# EAGLE design GPduino-R (EAGLE 6.5.0)
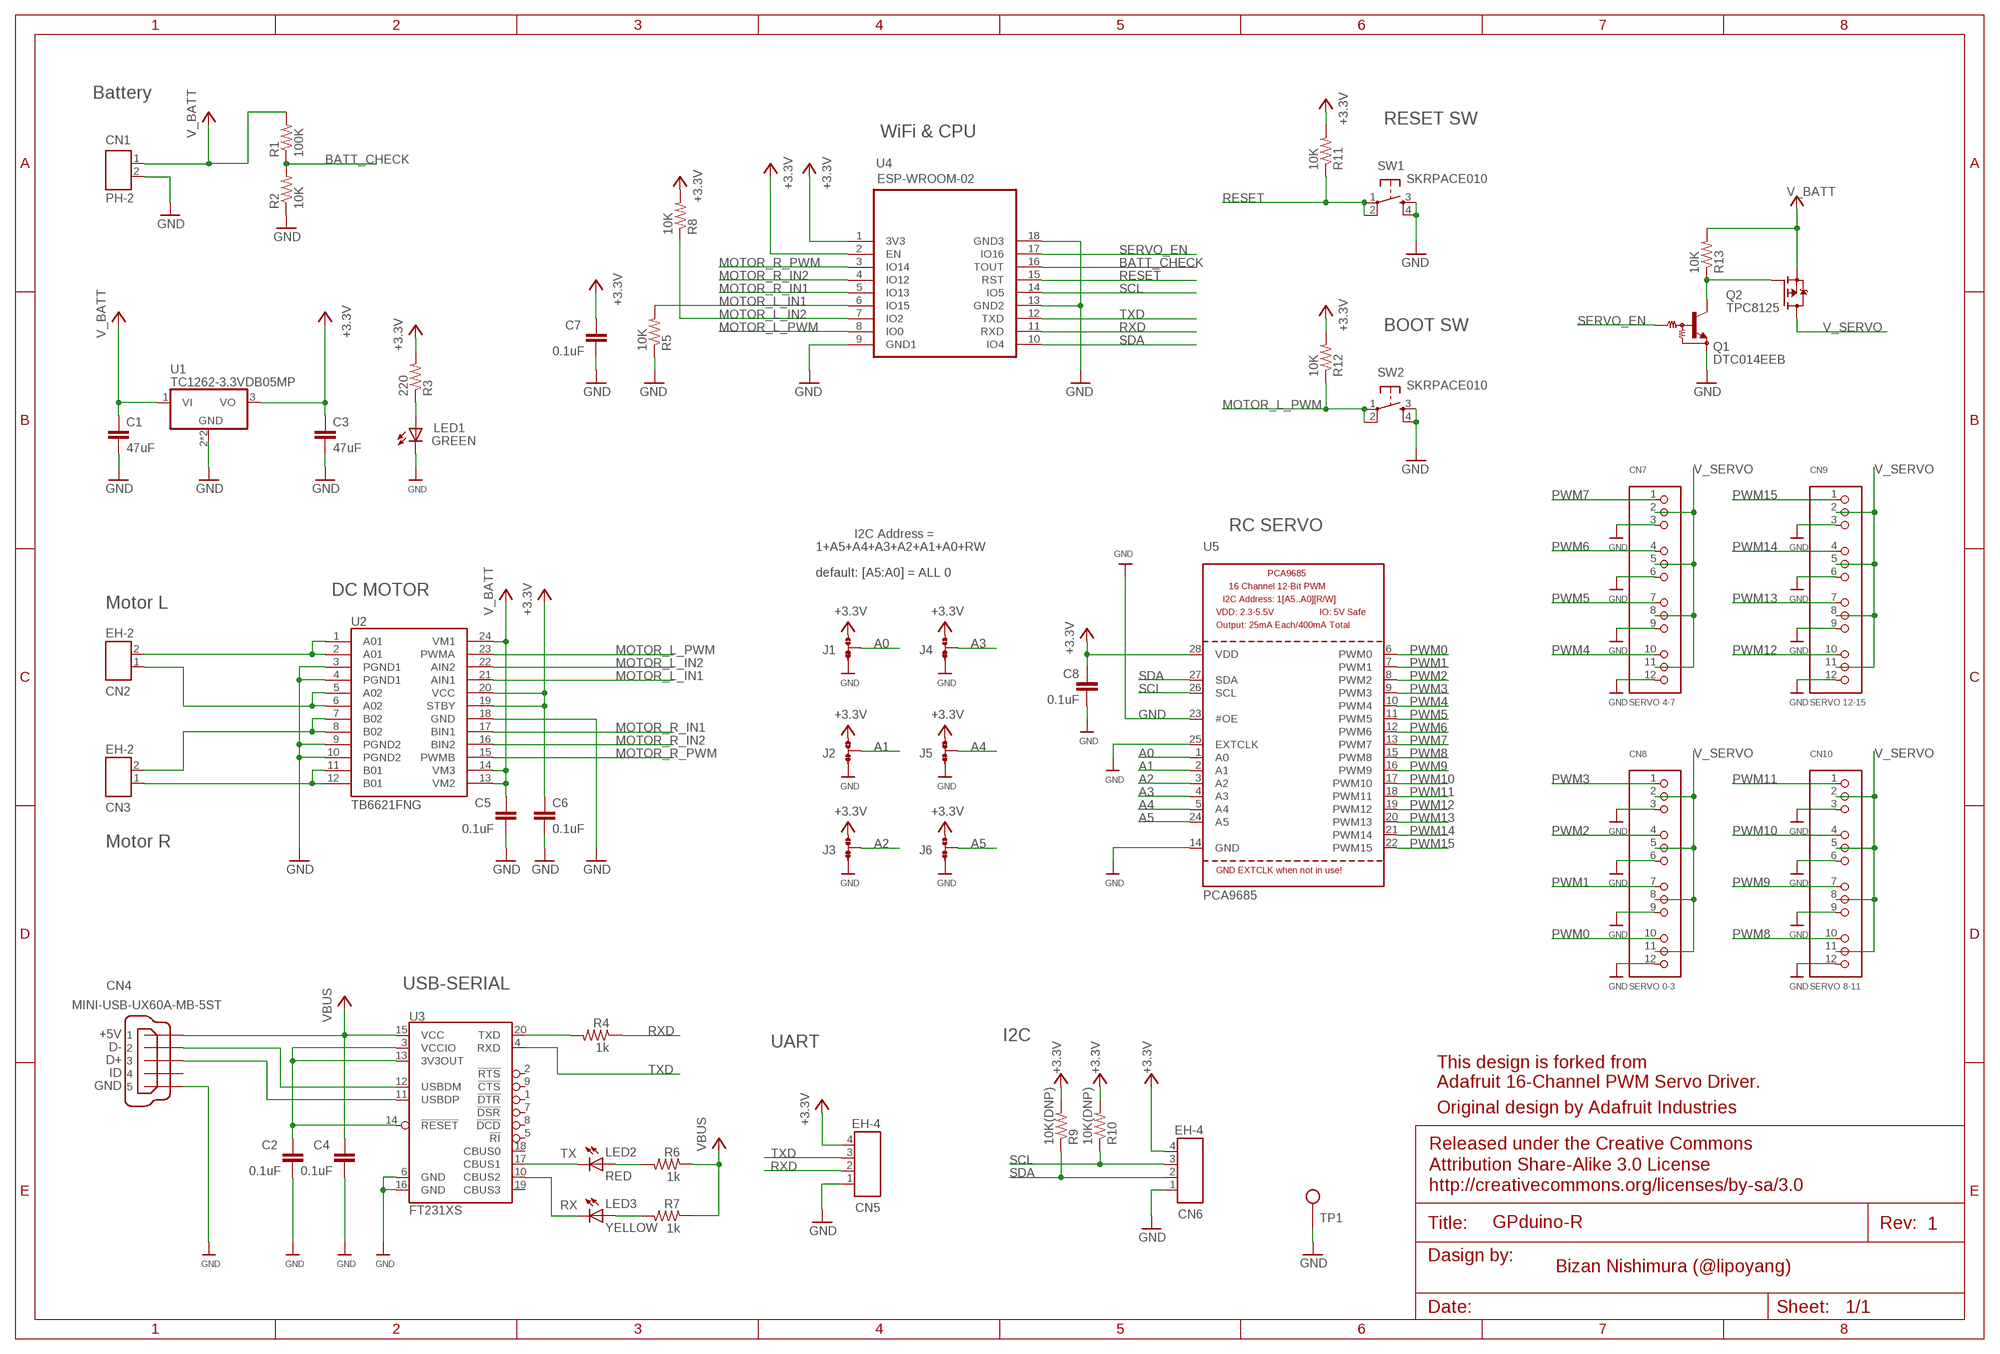
[diagram p0: schematic, sheet 1]

## Parts
C1  47uF  C-EUC3216  [C3216]
C2  0.1uF  C-EUC1608  [C1608]
C3  47uF  C-EUC3216  [C3216]
C4  0.1uF  C-EUC1608  [C1608]
C5  0.1uF  C-EUC1608  [C1608]
C6  0.1uF  C-EUC1608  [C1608]
C7  0.1uF  C-EUC1608  [C1608]
C8  0.1uF  C-EUC1608  [C1608]
CN1  PH-2  [PH-2]
CN2  EH-2  [EH-2]
CN3  EH-2  [EH-2]
CN4  MINI-USB-UX60A-MB-5ST  [UX60A-MB-5ST]
CN5  EH-4  [EH-4]
CN6  EH-4  [EH-4]
CN7  SERVO 4-7  HEADER-3X04  [3X04]
CN8  SERVO 0-3  HEADER-3X04  [3X04]
CN9  SERVO 12-15  HEADER-3X04  [3X04]
CN10  SERVO 8-11  HEADER-3X04  [3X04]
J1  JUMP-SHORTB  [JUMP-SHORT]
J2  JUMP-SHORTB  [JUMP-SHORT]
J3  JUMP-SHORTB  [JUMP-SHORT]
J4  JUMP-SHORTB  [JUMP-SHORT]
J5  JUMP-SHORTB  [JUMP-SHORT]
J6  JUMP-SHORTB  [JUMP-SHORT]
LED1  GREEN  LEDCHIPLED_0603  [CHIPLED_0603]
LED2  RED  LEDCHIPLED_0603  [CHIPLED_0603]
LED3  YELLOW  LEDCHIPLED_0603  [CHIPLED_0603]
Q1  DTC014EEB  DIGITORASC89  [SOT490]
Q2  TPC8125  [SO-8]
R1  100K  RESISTOR0603-RES  [0603-RES]
R2  10K  RESISTOR0603-RES  [0603-RES]
R3  220  RESISTOR0603-RES  [0603-RES]
R4  1k  RESISTOR0603-RES  [0603-RES]
R5  10K  RESISTOR0603-RES  [0603-RES]
R6  1k  RESISTOR0603-RES  [0603-RES]
R7  1k  RESISTOR0603-RES  [0603-RES]
R8  10K  RESISTOR0603-RES  [0603-RES]
R9  10K(DNP)  RESISTOR0603-RES  [0603-RES]
R10  10K(DNP)  RESISTOR0603-RES  [0603-RES]
R11  10K  RESISTOR0603-RES  [0603-RES]
R12  10K  RESISTOR0603-RES  [0603-RES]
R13  10K  RESISTOR0603-RES  [0603-RES]
SW1  SKRPACE010  [SKRPACE010]
SW2  SKRPACE010  [SKRPACE010]
TP1  TEST_PIN  [TEST_PIN]
U1  TC1262-3.3VDB05MP  [SOT223]
U2  TB6621FNG  [SSOP24]
U3  FT231XS  [SSOP20]
U4  ESP-WROOM-02  ESP-WROOM-02FRONT-FACE  [FRONT-FACE]
U5  PCA9685  [TSSOP28]

## Nets
+3V3: C3.1 C6.1 C7.1 C8.1 CN5.4 CN6.4 J1.1 J2.1 J3.1 J4.1 J5.1 J6.1 R3.2 R8.2 R9.2 R10.2 R11.2 R12.2 U1.3(VO) U2.19(STBY) U2.20(VCC) U4.1(3V3) U4.2(EN) U5.28(VDD) ; supply symbol labelled +3.3V
A0: J1.2 U5.1(A0)
A01: CN2.2 U2.1(A01) U2.2(A01)
A1: J2.2 U5.2(A1)
A02: CN2.1 U2.5(A02) U2.6(A02)
A2: J3.2 U5.3(A2)
A3: J4.2 U5.4(A3)
A4: J5.2 U5.5(A4)
A5: J6.2 U5.24(A5)
BATT_CHECK: R1.1 R2.2 U4.16(TOUT)
GND: C1.2 C2.2 C3.2 C4.2 C5.2 C6.2 C7.2 C8.2 CN1.2 CN4.5 CN5.1 CN6.1 CN7.3 CN7.6 CN7.9 CN7.12 CN8.3 CN8.6 CN8.9 CN8.12 CN9.3 CN9.6 CN9.9 CN9.12 CN10.3 CN10.6 CN10.9 CN10.12 J1.3 J2.3 J3.3 J4.3 J5.3 J6.3 LED1.C Q1.2(E) R2.1 R5.1 SW1.3 SW1.4 SW2.3 SW2.4 TP1.1 U1.2(GND) U1.4(GND) U2.3(PGND1) U2.4(PGND1) U2.9(PGND2) U2.10(PGND2) U2.18(GND) U3.6(GND) U3.16(GND) U4.9(GND1) U4.13(GND2) U4.18(GND3) U5.14(GND) U5.23(#OE) U5.25(EXTCLK)
MOTOR_L_IN1: R5.2 U2.21(AIN1) U4.6(IO15)
MOTOR_L_IN2: R8.1 U2.22(AIN2) U4.7(IO2)
MOTOR_L_PWM: R12.1 SW2.1 SW2.2 U2.23(PWMA) U4.8(IO0)
MOTOR_R_IN1: U2.17(BIN1) U4.5(IO13)
MOTOR_R_IN2: U2.16(BIN2) U4.4(IO12)
MOTOR_R_PWM: U2.15(PWMB) U4.3(IO14)
N$1: LED1.A R3.1
N$3: R4.2 U3.20(TXD)
N$5: CN3.1 U2.11(B01) U2.12(B01)
N$6: CN3.2 U2.7(B02) U2.8(B02)
N$8: LED2.C U3.17(CBUS1)
N$9: LED3.C U3.10(CBUS2)
N$10: LED2.A R6.2
N$11: LED3.A R7.2
N$13: CN4.2 U3.12(USBDM)
N$14: CN4.3 U3.11(USBDP)
N$15: C2.1 U3.3(VCCIO) U3.13(3V3OUT) U3.14(!RESET)
N$16: Q1.3(C) Q2.4(G) R13.1
PWM0: CN8.10 U5.6(PWM0)
PWM1: CN8.7 U5.7(PWM1)
PWM2: CN8.4 U5.8(PWM2)
PWM3: CN8.1 U5.9(PWM3)
PWM4: CN7.10 U5.10(PWM4)
PWM5: CN7.7 U5.11(PWM5)
PWM6: CN7.4 U5.12(PWM6)
PWM7: CN7.1 U5.13(PWM7)
PWM8: CN10.10 U5.15(PWM8)
PWM9: CN10.7 U5.16(PWM9)
PWM10: CN10.4 U5.17(PWM10)
PWM11: CN10.1 U5.18(PWM11)
PWM12: CN9.10 U5.19(PWM12)
PWM13: CN9.7 U5.20(PWM13)
PWM14: CN9.4 U5.21(PWM14)
PWM15: CN9.1 U5.22(PWM15)
RESET: R11.1 SW1.1 SW1.2 U4.15(RST)
RXD: CN5.2 R4.1 U4.11(RXD)
SCL: CN6.3 R10.1 U4.14(IO5) U5.26(SCL)
SDA: CN6.2 R9.1 U4.10(IO4) U5.27(SDA)
SERVO_EN: Q1.1(B) U4.17(IO16)
TXD: CN5.3 U3.4(RXD) U4.12(TXD)
V_BATT: C1.1 C5.1 CN1.1 Q2.1(S) Q2.2(S) Q2.3(S) R1.2 R13.2 U1.1(VI) U2.13(VM2) U2.14(VM3) U2.24(VM1)
V_SERVO: CN7.2 CN7.5 CN7.8 CN7.11 CN8.2 CN8.5 CN8.8 CN8.11 CN9.2 CN9.5 CN9.8 CN9.11 CN10.2 CN10.5 CN10.8 CN10.11 Q2.5(D) Q2.6(D) Q2.7(D) Q2.8(D)
VBUS: C4.1 CN4.1 R6.1 R7.1 U3.15(VCC)
Unconnected: CN4.4 U3.1(!DTR) U3.2(!RTS) U3.5(!RI) U3.7(!DSR) U3.8(!DCD) U3.9(!CTS) U3.18(CBUS0) U3.19(CBUS3)

## Notes on the sheet
- Battery
- RESET SW
- WiFi & CPU
- BOOT SW
- RC SERVO
- I2C Address =
- 1+A5+A4+A3+A2+A1+A0+RW
- default: [A5:A0] = ALL 0
- DC MOTOR
- Motor L
- Motor R
- USB-SERIAL
- I2C
- UART
- This design is forked from 
  Adafruit 16-Channel PWM Servo Driver.
- Original design by Adafruit Industries
- TX
- RX
- 1
- Bizan Nishimura (@lipoyang)

## Library data of the parts
C1-C8 = resistor:C-EU: CAPACITOR, European symbol
CN1 = lipoyang_mechanical:PH-2
CN2 CN3 = lipoyang_mechanical:EH-2
CN4 = lipoyang_mechanical:MINI-USB-: MINI USB Connector Source: http://www.hirose.co.jp/cataloge_hp/e24000019.pdf; OC_FARNELL: unknown; OC_NEWARK: unknown
CN5 CN6 = lipoyang_mechanical:EH-4
CN7-CN10 = microbuilder:HEADER-3X04
J1-J6 = lipoyang_mechanical:JUMP-SHORT: SMD 0R 0805 Jumper
LED1-LED3 = lipoyang:LED: LED OSRAM: - CHIPLED LG R971, LG N971, LY N971, LG Q971, LY Q971, LO R971, LY R971 LH N974, LH R974 LS Q976, LO Q976, LY Q976 LO Q996 - Hyper CHIPLED LW Q18S LB Q993, LB Q99A, LB R99A - SideLED LS A670, LO A670, LY A670, LG A670, LP A670 LB A673, LV A673, LT A673, LW A673 LH A674 LY A675 LS A676, LA A676, LO A676, LY A676, LW A676 LS A679, LY A679, LG A679 - Hyper Micro SIDELED® LS Y876, LA Y876, LO Y876, LY Y876 LT Y87S - SmartLED LW L88C, LW L88S LB L89C, LB L89S, LG L890 LS L89K, LO L89K, LY L89K LS L896, LA L896, LO L896, LY L896 - TOPLED LS T670, LO T670, LY T670, LG T670, LP T670 LSG T670, LSP T670, LSY T670, LOP T670, LYG T670 LG T671, LOG T671, LSG T671 LB T673, LV T673, LT T673, LW T673 LH T674 LS T676, LA T676, LO T676, LY T676, LB T676, LH T676, LSB T676, LW T676 LB T67C, LV T67C, LT T67C, LS T67K, LO T67K, LY T67K, LW E67C LS E67B, LA E67B, LO E67B, LY E67B, LB E67C, LV E67C, LT E67C LW T67C LS T679, LY T679, LG T679 LS T770, LO T770, LY T770, LG T770, LP T770 LB T773, LV T773, LT T773, LW T773 LH T774 LS E675, LA E675, LY E675, LS T675 LS T776, LA T776, LO T776, LY T776, LB T776 LHGB T686 LT T68C, LB T68C - Hyper Mini TOPLED® LB M676 - Mini TOPLED Santana® LG M470 LS M47K, LO M47K, LY M47K Source: http://www.osram.convergy.de LUXEON: - LUMILED® LXK2-PW12-R00, LXK2-PW12-S00, LXK2-PW14-U00, LXK2-PW14-V00 LXK2-PM12-R00, LXK2-PM12-S00, LXK2-PM14-U00 LXK2-PE12-Q00, LXK2-PE12-R00, LXK2-PE12-S00, LXK2-PE14-T00, LXK2-PE14-U00 LXK2-PB12-K00, LXK2-PB12-L00, LXK2-PB12-M00, LXK2-PB14-N00, LXK2-PB14-P00, LXK2-PB14-Q00 LXK2-PR12-L00, LXK2-PR12-M00, LXK2-PR14-Q00, LXK2-PR14-R00 LXK2-PD12-Q00, LXK2-PD12-R00, LXK2-PD12-S00 LXK2-PH12-R00, LXK2-PH12-S00 LXK2-PL12-P00, LXK2-PL12-Q00, LXK2-PL12-R00 Source: www.luxeon.com KINGBRIGHT: KA-3528ASYC Source: www.kingbright.com
Q1 = lipoyang_discrete:DIGITORA: NPN Bias Resistor Transistor
Q2 = lipoyang_discrete:TPC8125: OptiMOS(R)-P Small-Signal-Transistor P-Channel, Enhancement mode, Super Logic Level (2.5 V rated) RDS(on) 8mOhm, ID -14.9 a Source: http://www.infineon.com/upload/Document/cmc_upload/documents/011/3655/BSO201SP_211201.pdf
R1-R13 = SparkFun:RESISTOR: Resistor Basic schematic elements and footprints for 0603, 1206, and PTH resistors.
SW1 SW2 = lipoyang_mechanical:SKRPACE010
TP1 = lipoyang:TEST_PIN: Test Pin
U1 = lipoyang:TC1262-3.3VDB: Positive VOLTAGE REGULATOR Source: http://cache.national.com/ds/LM/LM340.pdf
U2 = SparkFun:TB6621FNG: Toshiba 1A motor driver
U3 = ftdi:FT231XS: FTDI FT231X Full Speed USB to Full-handshake UART This USB2.0 Full Speed IC offers a compact bridge to full handshake UART interfaces. The device is a UART, capable of operating up to 3MBaud, with low power consumption (8mA). The FT231X includes the complete FT-X series feature set and enables USB to be added into a system design quickly and easily over a UART interface. See: http://www.ftdichip.com/Products/ICs/FT231X.html
U4 = esp-wroom-02:ESP-WROOM-02: WiFi module - ESP-WROOM-02
U5 = microbuilder:PCA9685: PCA9685 - 16 Channel 12-Bit I2C PWM Controller 5.0V tolerant 16 channel, 12-bit I2C PWM controller with 25mA per output (max. 400mA total) Digikey: 568-5931-1-ND

## Net classes
0 default: width 0.203 mm
1 vcc: width 0.254 mm

## Board
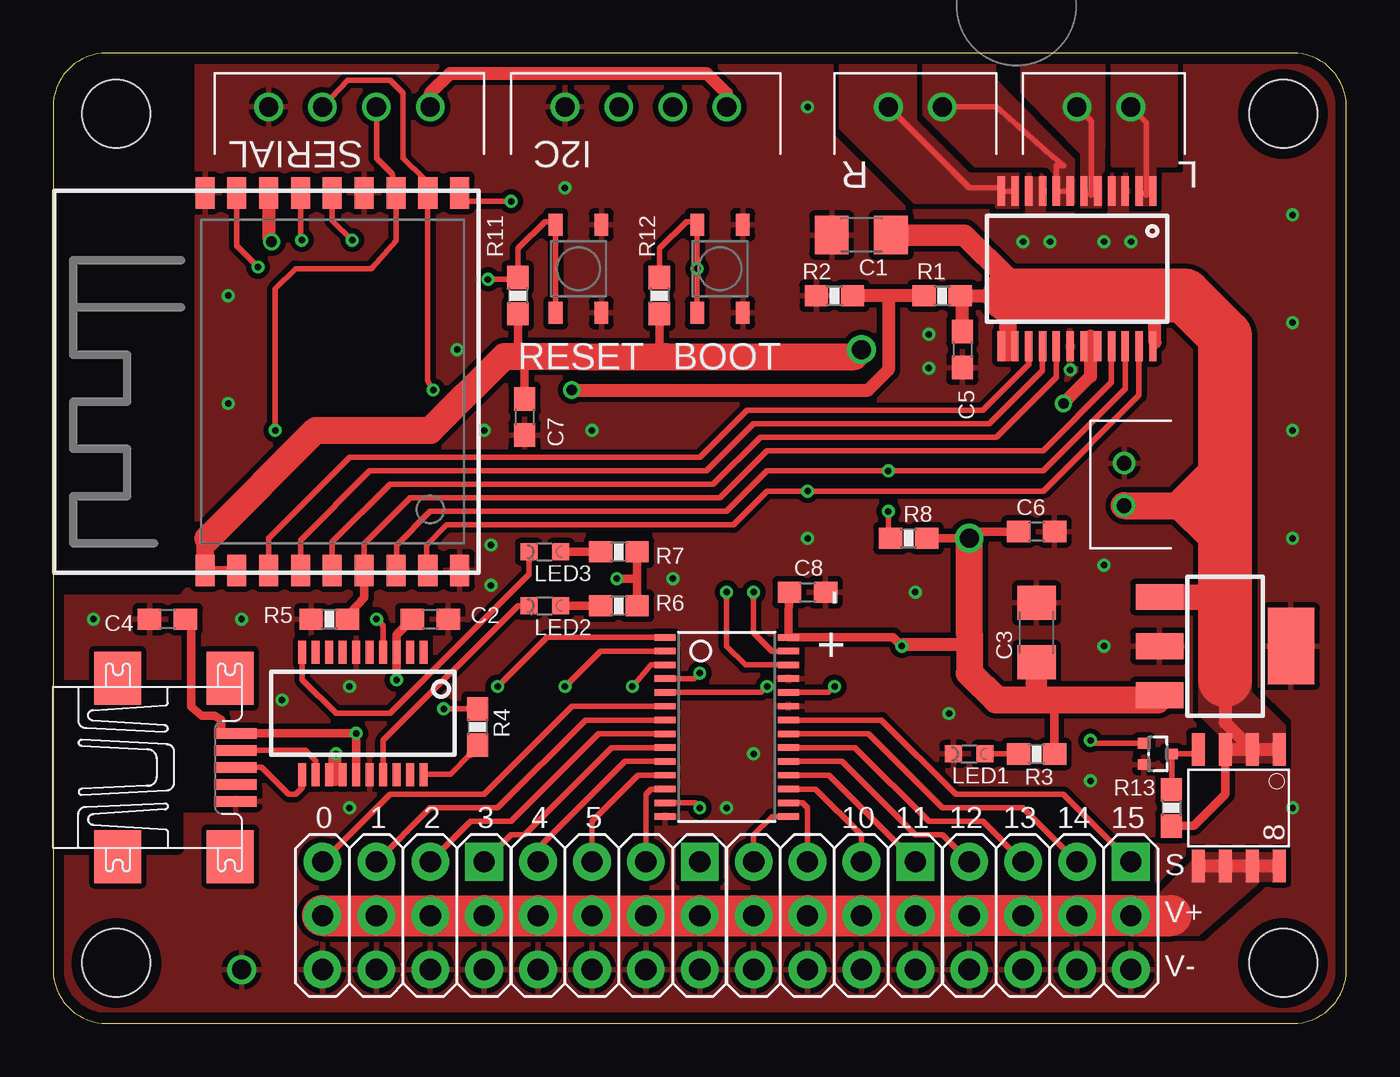
[diagram p1: board, top side]
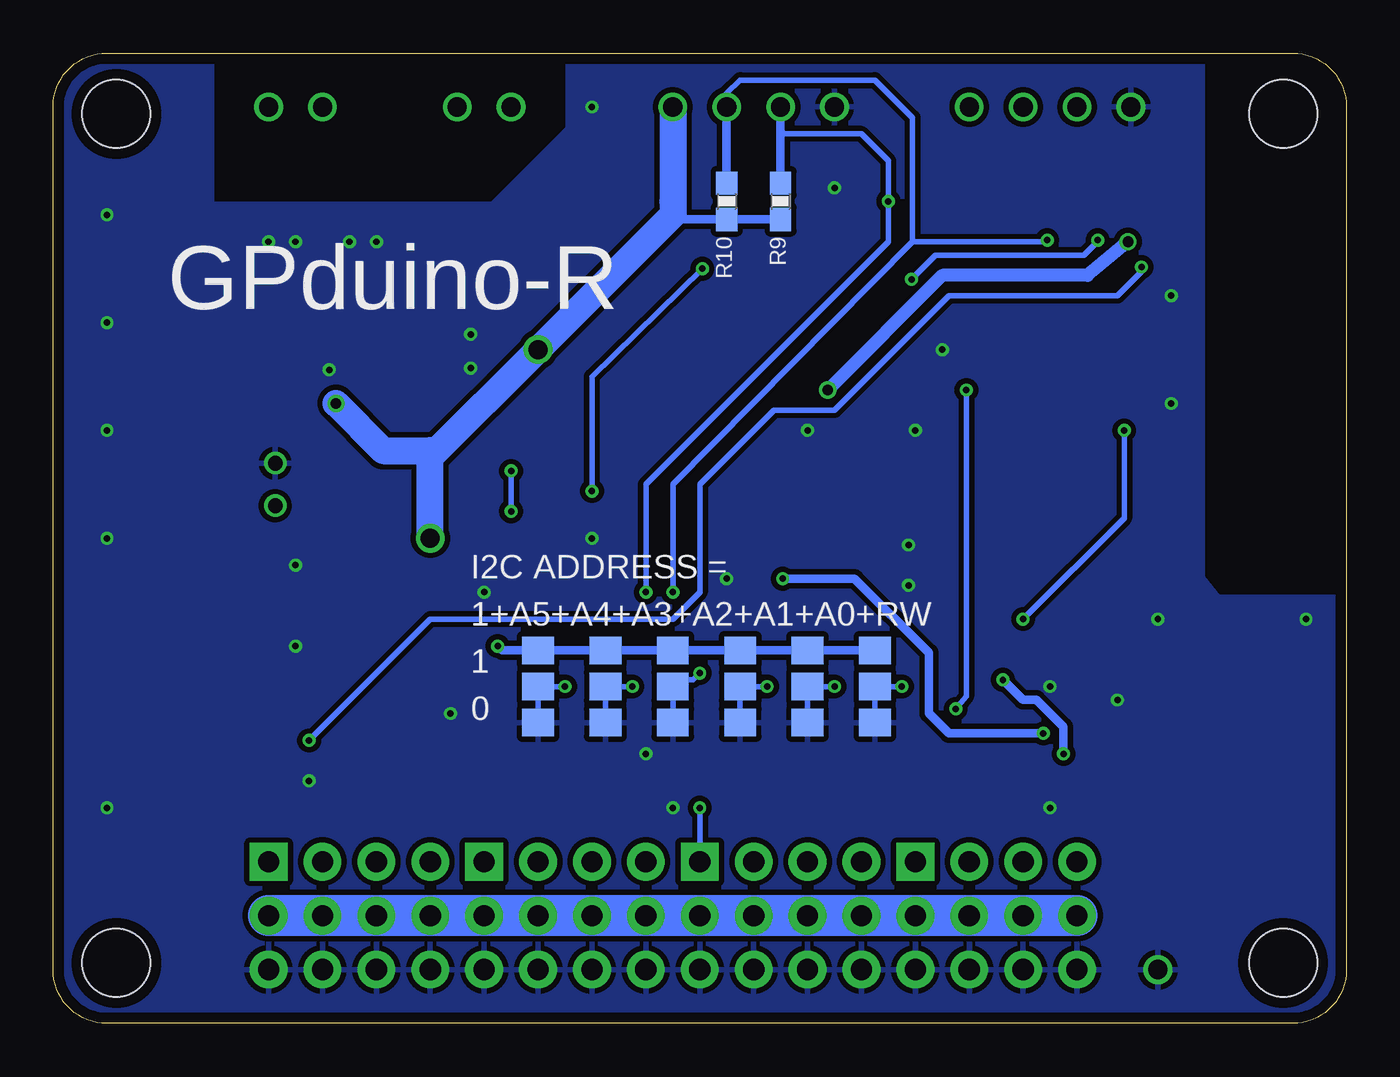
[diagram p2: board, bottom side, seen from below]

Size 60.96 x 45.72 mm. Coordinates in mm from the lower left corner, seen from the top.
Outline: 0,2.54 arc90 2.54,0 58.42,0 arc90 60.96,2.54 60.96,43.18 arc90 58.42,45.72 2.54,45.72 arc90 0,43.18 0,2.54
Copper layers (1*16): Top 0.035mm / dielectric 1.6mm / Bottom 0.035mm
Design rules "Elecrow_2-layer_PCB_eagle_rule": minimum track width 6mil, minimum drill 12mil, track to track 6mil, track to pad 6mil, pad to pad 6mil, via to via 8mil, smd to smd 0mil, copper to edge 20mil, drill to drill 10mil, minimum pad ring 6mil, minimum via ring 6mil, stop-mask expansion 0mil, vias tented up to drill 100mil, thermal gap 10mil
Holes 3.2 mm at 2.98,42.86 57.98,42.86 2.98,2.86 57.98,2.86

### Footprints (pad centres in the part's own frame; a part is rotated, then mirrored left to right if it is on the bottom)
C3216 = smd 1.6 x 1.8: 1 -1.4,0; 2 1.4,0
C1608 = smd 1.1 x 1: 1 -0.85,0; 2 0.85,0
PH-2 = drill 0.7: 1 -1,0; 2 1,0
EH-2 = drill 0.9: 1 -1.27,0; 2 1.27,0
UX60A-MB-5ST = smd 2 x 0.5: 1 2.25,1.6; 2 2.25,0.8; 3 2.25,0; 4 2.25,-0.8; 5 2.25,-1.6 | smd 2.2 x 2.5: M1 -3.3,-4.2; M2 -3.3,4.2; M3 2,4.2; M4 2,-4.2
EH-4 = drill 0.9: 1 -3.81,0; 2 -1.27,0; 3 1.27,0; 4 3.81,0
3X04 = drill 1 pad 1.778 square: 1 -3.81,-2.54 | drill 1 pad 1.778: 2 -3.81,0; 3 -3.81,2.54; 4 -1.27,-2.54; 5 -1.27,0; 6 -1.27,2.54; 7 1.27,-2.54; 8 1.27,0; 9 1.27,2.54; 10 3.81,-2.54; 11 3.81,0; 12 3.81,2.54
JUMP-SHORT = smd 1.5 x 1.3: 1 0,1.7; 2 0,0; 3 0,-1.7
CHIPLED_0603 = smd 0.8 x 0.8: A 0,-0.75; C 0,0.75
SOT490 = smd 0.5 x 0.6: 1 -0.5,-0.65; 2 0.5,-0.65; 3 0,0.65
SO-8 = smd 1.524 x 0.61: 1 -2.743,1.905; 2 -2.743,0.635; 3 -2.743,-0.635; 4 -2.743,-1.905; 5 2.743,-1.905; 6 2.743,-0.635; 7 2.743,0.635; 8 2.743,1.905
0603-RES = smd 1.1 x 1: 1 -0.85,0; 2 0.85,0
SKRPACE010 = smd 1.05 x 0.65: 1 -2.075,1.075; 2 2.075,1.075; 3 -2.075,-1.075; 4 2.075,-1.075
TEST_PIN = drill 0.914: 1 0,0
SOT223 = smd 1.219 x 2.235: 1 -2.311,-3.099; 2 0,-3.099; 3 2.311,-3.099 | smd 3.6 x 2.2: 4 0,3.099
SSOP24 = smd 0.348 x 1.397: 1 -3.575,-3.656; 2 -2.925,-3.656; 3 -2.275,-3.656; 4 -1.625,-3.656; 5 -0.975,-3.656; 6 -0.325,-3.656; 7 0.325,-3.656; 8 0.975,-3.656; 9 1.625,-3.656; 10 2.275,-3.656; 11 2.925,-3.656; 12 3.575,-3.656; 13 3.575,3.656; 14 2.925,3.656; 15 2.275,3.656; 16 1.625,3.656; 17 0.975,3.656; 18 0.325,3.656; 19 -0.325,3.656; 20 -0.975,3.656; 21 -1.625,3.656; 22 -2.275,3.656; 23 -2.925,3.656; 24 -3.575,3.656
SSOP20 = smd 0.381 x 1.093: 1 -2.857,-2.88; 2 -2.223,-2.88; 3 -1.587,-2.88; 4 -0.953,-2.88; 5 -0.318,-2.88; 6 0.318,-2.88; 7 0.953,-2.88; 8 1.587,-2.88; 9 2.223,-2.88; 10 2.857,-2.88; 11 2.857,2.88; 12 2.223,2.88; 13 1.587,2.88; 14 0.953,2.88; 15 0.318,2.88; 16 -0.318,2.88; 17 -0.953,2.88; 18 -1.587,2.88; 19 -2.223,2.88; 20 -2.857,2.88
FRONT-FACE = smd 1.485 x 0.9: 1 -8.893,4.9; 2 -8.893,3.4; 3 -8.893,1.9; 4 -8.893,0.4; 5 -8.893,-1.1; 6 -8.893,-2.6; 7 -8.893,-4.1; 8 -8.893,-5.6; 9 -8.893,-7.1; 10 8.893,-7.1; 11 8.893,-5.6; 12 8.893,-4.1; 13 8.893,-2.6; 14 8.893,-1.1; 15 8.893,0.4; 16 8.893,1.9; 17 8.893,3.4; 18 8.893,4.9
TSSOP28 = smd 0.305 x 0.991: 1 -4.225,-2.918; 2 -3.575,-2.918; 3 -2.925,-2.918; 4 -2.275,-2.918; 5 -1.625,-2.918; 6 -0.975,-2.918; 7 -0.325,-2.918; 8 0.325,-2.918; 9 0.975,-2.918; 10 1.625,-2.918; 11 2.275,-2.918; 12 2.925,-2.918; 13 3.575,-2.918; 14 4.225,-2.918; 15 4.225,2.918; 16 3.575,2.918; 17 2.925,2.918; 18 2.275,2.918; 19 1.625,2.918; 20 0.975,2.918; 21 0.325,2.918; 22 -0.325,2.918; 23 -0.975,2.918; 24 -1.625,2.918; 25 -2.275,2.918; 26 -2.925,2.918; 27 -3.575,2.918; 28 -4.225,2.918

### Placement (x,y rotation side)
C1  38.1,37.15 180 top
C2  17.78,19.05 0 top
C3  46.35,18.41 90 top
C4  5.4,19.05 180 top
C5  42.86,31.75 270 top
C6  46.35,23.18 0 top
C7  22.23,28.57 270 top
C8  35.56,20.32 0 top
CN1  50.48,25.4 90 top
CN2  49.53,43.18 0 top
CN3  40.64,43.18 0 top
CN4  6.35,12.06 0 top
CN5  13.97,43.18 0 top
CN6  27.94,43.18 0 top
CN7  26.67,5.08 180 top
CN8  16.51,5.08 180 top
CN9  46.99,5.08 180 top
CN10  36.83,5.08 180 top
J1  22.23,15.88 0 bottom
J2  25.4,15.88 0 bottom
J3  28.57,15.88 0 bottom
J4  31.75,15.88 0 bottom
J5  34.92,15.88 0 bottom
J6  38.1,15.88 0 bottom
LED1  43.18,12.7 90 top
LED2  23.18,19.68 90 top
LED3  23.18,22.23 90 top
Q1  52.07,12.7 270 top
Q2  55.88,10.16 270 top
R1  41.91,34.29 0 top
R2  36.83,34.29 0 top
R3  46.35,12.7 0 top
R4  20,13.97 270 top
R5  13.02,19.05 0 top
R6  26.67,19.68 180 top
R7  26.67,22.23 180 top
R8  40.32,22.86 0 top
R9  26.67,38.73 270 bottom
R10  29.21,38.73 270 bottom
R11  21.91,34.29 270 top
R12  28.57,34.29 270 top
R13  52.7,10.16 270 top
SW1  24.77,35.56 90 top
SW2  31.43,35.56 90 top
TP1  8.89,2.54 0 top
U1  55.24,17.78 270 top
U2  48.26,35.56 180 top
U3  14.61,14.61 180 top
U4  12.06,30.24 90 top
U5  31.75,13.97 270 top

### Tracks (layer width: path | path; a pad name or v marks a point on that pad's centre or on a via)
+3V3  (via drill 0.3, 0.5, 0.9)
  Top 0.254: 6.91,21.27 U4.1 | 25.08,31.11 24.77,31.42 24.76,31.43 | 52.7,15.88 52.07,15.24 52.07,15.39 U1.3 | 43.18,18.41 43.18,18.02 | 40.09,17.86 v40.01,17.78 | 28.57,31.74 28.89,31.42 | 8.61,21.23 U4.2 | 47.2,15.14 47.31,15.24 | U2.20 49.23,32.06 48.9,32.4 48.59,32.09 U2.19
  Top 0.406: R12.2 28.57,31.74 | C6.1 43.5,23.18 v43.18,22.86 R8.2 | U4.2 U4.1 | R3.2 47.2,15.14 | v40.01,17.78 39.59,18.2 U5.28 34.67,19.32 C8.1 | R11.2 21.91,31.43 | C7.1 22.23,31.11 22.54,31.43
  Top 0.61: CN5.4 17.78,43.81 18.73,44.77 30.8,44.77 31.75,43.81 CN6.4 | 40.09,17.86 43.1,17.86 43.18,17.78 | 48.9,32.4 48.9,30.48 v47.62,29.21
  Top 0.813: U4.1 7.16,22.72 7.3,22.86
  Top 1.016: C3.1 46.35,15.24
  Top 1.27: 52.07,15.24 47.31,15.24 46.35,15.24 44.45,15.24 43.18,16.51 43.18,17.78 43.18,18.41 v43.18,22.86 | 24.77,31.42 28.89,31.42 37.77,31.42 v38.1,31.75 | 7.3,22.86 12.38,27.94 17.78,27.94 21.27,31.43 21.91,31.43 22.54,31.43 24.76,31.43
  Bottom 0.406: J1.1 J2.1 J3.1 J4.1 J5.1 J6.1 39.8,17.57 v40.01,17.78 | R9.2 R10.2 31.61,37.88 31.75,38.73
  Bottom 1.27: 43.18,26.67 v38.1,31.75 31.75,38.1 31.75,38.73 CN6.4 | v43.18,22.86 43.18,26.67 | 43.18,26.67 43.18,26.99 45.4,26.99 v47.62,29.21
A0  (via drill 0.3)
  Top 0.254: 28.99,18.2 U5.1 23.27,18.2 v20.95,15.88
  Bottom 0.254: J1.2 v20.95,15.88
A01
  Top 0.254: U2.1 51.54,39.02 | 51.54,39.02 U2.2 | CN2.2 51.54,42.44 51.54,40.85 51.54,39.02
  pour Top (isolate 0.254, no thermals): 49.97,45.72 49.97,40.45 50.98,40.45 51.13,40.43 51.13,38.63 51.87,38.63 51.87,40.43 52.02,40.45 52.9,40.45 52.9,45.72
A1  (via drill 0.3)
  Top 0.254: U5.2 25.8,17.55 v24.13,15.88
  Bottom 0.254: J2.2 v24.13,15.88
A02
  Top 0.254: U2.5 48.94,39.02 | 48.94,39.02 U2.6 | 48.94,39.02 48.94,40.91 48.94,42.5 CN2.1
  pour Top (isolate 0.254, rank 2, no thermals): 49.53,45.72 49.43,38.52 48.26,38.52 48.26,40.64 45.72,43.18 45.72,45.72
A2  (via drill 0.3)
  Top 0.254: U5.3 28.19,16.89 v27.3,15.88
  Bottom 0.254: J3.2 v27.3,15.88
A3  (via drill 0.3)
  Top 0.254: U5.4 30.21,16.25 v30.48,16.51
  Bottom 0.254: J4.2 31.43,16.19 30.8,16.19 v30.48,16.51
A4  (via drill 0.3)
  Top 0.254: U5.5 33.38,15.6 v33.66,15.88
  Bottom 0.254: J5.2 v33.66,15.88
A5  (via drill 0.3)
  Top 0.254: U5.24 36.55,15.6 v36.83,15.88
  Bottom 0.254: J6.2 v36.83,15.88
BATT_CHECK  (via drill 0.5)
  Top 0.61: U4.16 10.16,36.98 v10.29,36.83 | v24.45,29.84 38.42,29.84 39.37,30.8 39.37,34.29 | 39.37,34.29 R2.2 | R1.1 39.37,34.29
  Bottom 0.61: v10.29,36.83 12.2,35.24 19.05,35.24 v24.45,29.84
GND  (via drill 0.3)
  other vias: 47.94,30.8 41.27,32.47 41.27,30.88 33.02,12.7 31.75,10.16 42.23,14.61 48.9,11.43 40.64,20.32 35.56,22.86 29.21,20.95 1.91,19.05 8.89,19.05 20.64,22.54 13.97,15.88 58.42,22.86 58.42,27.94 58.42,33.02 58.42,38.1 58.42,10.16 13.97,10.16 49.53,17.78 35.56,43.18 46.99,36.83 45.72,36.83 50.8,36.83 10.79,15.24 24.13,39.37 20.64,20.64 20.32,27.94 25.4,27.94 49.53,21.59 19.05,31.75 8.26,34.29 8.26,29.21 49.53,36.83
  pour Top (isolate 0.254, rank 3): -1.27,20.08 6.03,20.08 6.8,21.04 6.8,46.3 62.87,46.44 62.87,-0.64 -1.27,-0.64
  pour Bottom (isolate 0.254): -0.64,20.08 6.03,20.08 6.8,21.04 6.8,46.75 63.5,46.75 63.5,-1.27 -0.64,-1.27
  pour Top (isolate 0.254, no thermals): 45.93,39.79 46.69,39.78 46.68,37.84 45.93,37.86
  pour Top (isolate 0.254, no thermals): 49.84,39.79 50.59,39.79 50.6,37.85 49.83,37.87
MOTOR_L_IN1
  Top 0.254: U2.21 49.88,30.2 46.67,26.99 33.66,26.99 31.43,24.77 16.83,24.77 14.66,22.6 U4.6
  Top 0.406: R5.2 13.73,19.05 14.66,20.06 U4.6
MOTOR_L_IN2  (via drill 0.3)
  Top 0.254: U2.22 50.53,29.9 46.67,26.04 v39.37,26.04 33.66,26.04 31.75,24.13 17.78,24.13 16.19,22.54 16.19,21.38 U4.7 16.01,21.38 | R8.1 39.37,22.86 v39.37,24.13
  Bottom 0.254: v39.37,26.04 v39.37,24.13
MOTOR_L_PWM  (via drill 0.3)
  Top 0.254: U2.23 51.19,29.59 46.67,25.08 v35.56,25.08 33.66,25.08 32.07,23.5 18.55,23.5 17.6,22.54 17.6,21.46 U4.8 | 30.36,35.22 SW2.2 30.21,37.78 29.84,37.78 28.57,36.51 R12.1 | 30.36,35.22 SW2.1 | v30.36,35.56 30.38,35.24 30.36,35.22
  Bottom 0.254: v35.56,25.08 35.56,30.48 v30.36,35.56
MOTOR_R_IN1
  Top 0.254: U4.5 13.16,22.69 15.88,25.4 31.11,25.4 33.34,27.62 44.45,27.62 47.28,30.46 U2.17
MOTOR_R_IN2
  Top 0.254: U4.4 11.66,22.77 14.92,26.04 30.8,26.04 33.02,28.26 44.13,28.26 46.63,30.76 U2.16
MOTOR_R_PWM
  Top 0.254: U4.3 10.16,22.86 13.97,26.67 30.48,26.67 32.7,28.89 43.81,28.89 45.98,31.06 U2.15
N$1
  Top 0.254: LED1.A R3.1
N$3
  Top 0.254: 19.68,12.7 18.73,11.75 17.48,11.75
  Top 0.406: R4.2 19.68,12.7 | 17.48,11.75 U3.20
N$5
  Top 0.254: CN3.1 43.18,39.37 44.69,39.37 U2.12 U2.11
  pour Top (isolate 0.254, rank 2, no thermals): 37.15,45.72 37.15,42.23 40.64,38.73 44.5,38.73 44.5,38.5 45.5,38.5 45.5,40 45.49,40.01 43.5,40.01 40.64,42.86 40.64,45.72
N$6
  Top 0.254: CN3.2 44.45,43.18 46.99,40.96 47.64,40.42 47.28,40.42 U2.8 U2.7
  cutout Bottom: 53.34,38.73 53.34,45.72 36.83,45.72 36.83,42.23 40.32,38.73
  pour Top (isolate 0.254, no thermals): 41.08,45.72 41.08,42.86 43.5,40.45 46.8,40.43 46.9,40.43 47.23,40.1 47.23,38.63 47.5,38.65 48.03,38.65 48.03,40.64 44.32,44.45 44.32,45.72
N$8
  Top 0.254: U3.17 15.56,13.34 21.91,19.68 LED2.C
N$9
  Top 0.254: LED3.C 22.43,21.16 15.88,14.61 13.34,14.61 11.75,16.19 U3.10
N$10
  Top 0.406: LED2.A R6.2
N$11
  Top 0.406: LED3.A R7.2
N$13
  Top 0.254: CN4.2 11.9,12.87 12.38,12.38 U3.12
N$14
  Top 0.254: 11.75,12.06 U3.11 11.75,11.11 11.43,10.79 11.11,10.79 9.84,12.06 CN4.3
N$15  (via drill 0.3)
  Top 0.254: 13.3,11.5 13.02,11.68 U3.13 U3.14 | 13.3,12.66 v13.34,12.7
  Top 0.406: v16.19,16.19 U3.3 16.19,18.31 C2.1
  Top 0.61: 13.3,11.5 13.3,12.66
  Bottom 0.406: v13.34,12.7 13.34,13.97 14.61,15.24 15.24,15.24 v16.19,16.19
N$16
  Top 0.254: Q2.4 53.77,12.7 Q1.3 52.72,10.99 R13.1
PWM0
  Top 0.254: U5.6 24.47,14.95 20.32,10.79 15.88,10.79 CN8.10
PWM1
  Top 0.254: U5.7 25.09,14.29 20.95,10.16 17.78,10.16 CN8.7
PWM2
  Top 0.254: U5.8 25.71,13.64 21.59,9.53 19.68,9.53 CN8.4
PWM3
  Top 0.254: U5.9 26.33,12.99 22.23,8.89 21.59,8.89 CN8.1
PWM4
  Top 0.254: U5.10 26.95,12.35 22.86,8.26 CN7.10
PWM5
  Top 0.254: U5.11 27.57,11.7 25.4,9.53 CN7.7
PWM6
  Top 0.254: U5.12 28.19,11.04 27.94,10.79 CN7.4
PWM7  (via drill 0.3)
  Top 0.254: U5.13 30.25,10.39 v30.48,10.16
  Bottom 0.254: v30.48,10.16 CN7.1
PWM8
  Top 0.254: U5.15 33.88,9.74 33.02,8.89 CN10.10
PWM9
  Top 0.254: U5.16 35.33,10.39 35.56,10.16 CN10.7
PWM10
  Top 0.254: U5.17 35.95,11.04 38.1,8.89 CN10.4
PWM11
  Top 0.254: U5.18 36.56,11.7 CN10.1
PWM12
  Top 0.254: U5.19 37.19,12.35 40.64,8.89 41.91,8.89 CN9.10
PWM13
  Top 0.254: U5.20 37.8,12.99 41.27,9.53 43.81,9.53 CN9.7
PWM14
  Top 0.254: U5.21 38.42,13.64 41.91,10.16 45.72,10.16 CN9.4
PWM15
  Top 0.254: U5.22 39.05,14.29 42.55,10.79 47.62,10.79 CN9.1
RESET  (via drill 0.3)
  Top 0.254: U4.15 11.66,36.99 v11.72,36.91 | v20.5,35.06 21.57,35.06 R11.1 21.91,36.51 23.18,37.78 23.54,37.78 SW1.2 SW1.1
  Bottom 0.254: v20.5,35.06 19.37,36.2 12.38,36.2 11.72,36.85 v11.72,36.91
RXD  (via drill 0.3)
  Top 0.254: CN5.2 13.89,44.45 15.88,44.45 16.51,43.81 16.51,40.77 17.48,39.8 U4.11 17.64,30.28 v17.91,29.84 | v18.41,14.82 R4.1
  Bottom 0.254: v17.91,29.84 17.91,15.42 v18.41,14.82
SCL  (via drill 0.3)
  Top 0.254: v14.11,36.91 13.16,37.83 U4.14 | U5.26 32.63,16.89 31.75,17.78 v31.75,20.32
  Bottom 0.254: 20.45,36.83 31.75,25.4 v31.75,20.32 | 20.45,36.83 14.19,36.83 v14.11,36.91 | CN6.3 29.21,43.81 28.57,44.45 22.23,44.45 20.45,42.68 20.45,36.83
  Bottom 0.406: R10.1 CN6.3
SDA  (via drill 0.3)
  Top 0.254: U5.27 33.89,17.55 33.02,18.41 v33.02,20.32 | v21.59,38.73 19.38,38.73 U4.10
  Bottom 0.254: v33.02,20.32 33.02,25.4 21.59,36.83 v21.59,38.73 21.59,40.64 22.86,41.91 26.59,41.91 CN6.2
  Bottom 0.406: R9.1 CN6.2
SERVO_EN  (via drill 0.3)
  Top 0.254: U4.17 8.66,36.64 v9.66,35.64 | Q1.1 49.03,13.2 v48.9,13.34
  Bottom 0.254: v48.9,13.34 43.18,19.05 31.75,19.05 30.48,20.32 30.48,25.4 26.99,28.89 24.13,28.89 18.73,34.29 10.79,34.29 9.66,35.42 v9.66,35.64
TXD  (via drill 0.3)
  Top 0.254: CN5.3 15.24,40.77 15.98,40.03 U4.12 16.16,36.88 15.06,35.64 14.98,35.56 11.43,35.56 10.48,34.61 v10.48,27.94 | U3.4 15.56,18.73 v15.24,19.05
  Bottom 0.254: v10.48,27.94 10.48,23.81 v15.24,19.05
V_BATT
  Top 0.203: 55.24,25.4 54.61,25.4 54.29,25.72
  Top 0.254: 45.34,31.91 U2.14 45.34,31.93 45,31.6 44.69,31.91 U2.13 | U2.24 51.94,32.08 | 55.02,20.09 55.24,20.32 | 45,34.2 45.09,34.29
  Top 0.406: R13.2 53.76,9.31 55.24,10.79 Q2.3
  Top 0.61: 51.94,32.08 51.94,34.29 51.94,34.62 | Q2.2 Q2.3 | Q2.1 Q2.2 | 55.24,16.19 55.24,14.17 Q2.2 | R1.2 44.91,34.29 | C5.1 42.86,34.19
  Top 0.813: 54.26,24.4 55.24,23.5 | 45,31.6 45,34.2
  Top 1.016: C1.1 42.95,37.15 45,35.1 45,34.38 | 45,34.38 45.09,34.29 | 44.91,34.29 45,34.38 | 42.86,34.19 R1.2
  Top 1.2: U1.1 55.02,20.09
  Top 1.27: CN1.1 54.26,24.4 | 54.29,25.72 53.02,24.45 54.61,22.86
  Top 2.54: 55.24,16.19 55.24,20.32 55.24,23.5 55.24,25.4 55.24,32.38 53.34,34.29 51.94,34.29 45.09,34.29
  pour Top (no thermals): 54.1,16.51 54.1,14.61 55.05,13.65 55.05,12.38 57.98,12.38 57.98,13.97 56.39,15.56 56.39,16.51
V_SERVO
  Top 0.61: Q2.8 Q2.7 Q2.6 Q2.5
  Top 1.93: CN8.11 CN8.8 CN8.5 CN8.2 CN7.11 CN7.8 CN7.5 CN7.2 CN10.11 CN10.8 CN10.5 CN10.2 CN9.11 CN9.8 CN9.5 CN9.2 52.7,5.08
  Bottom 1.93: CN8.11 CN9.2
  pour Top (no thermals): 52.07,5.91 53.78,7.62 53.78,7.94 57.98,7.94 57.98,6.79 56.83,6.79 56.52,6.48 53.98,4.25 52.7,4.25
VBUS  (via drill 0.3)
  Top 0.254: R7.1 27.62,22.23 27.52,20.95 | CN4.1 7.92,13.66 | 6.5,18.63 C4.1
  Top 0.406: CN4.1 v14.29,13.66 U3.15 | R7.1 R6.1 | 27.52,20.95 v26.57,20.95 | 7.92,13.66 7.92,14.3 7.62,14.5 7,14.5 6.5,14.92 6.5,18.63
  Bottom 0.406: v26.57,20.95 23.18,20.95 19.68,17.46 19.68,14.61 18.75,13.66 v14.29,13.66

### Text on the board
tPlace: SERIAL | I2C | R | L | RESET | BOOT | - | + | 0 | 1 | 2 | 3 | 4 | 5 | 10 | 11 | 12 | 13 | 14 | 15 | S | V+ | V-
bPlace: GPduino-R | I2C ADDRESS = | 1+A5+A4+A3+A2+A1+A0+RW | 1 | 0